# Altium schematic sheet DCSource3V5.SchDoc
size A4; DocumentNumber: 3; SheetNumber: 3; SheetTotal: 5
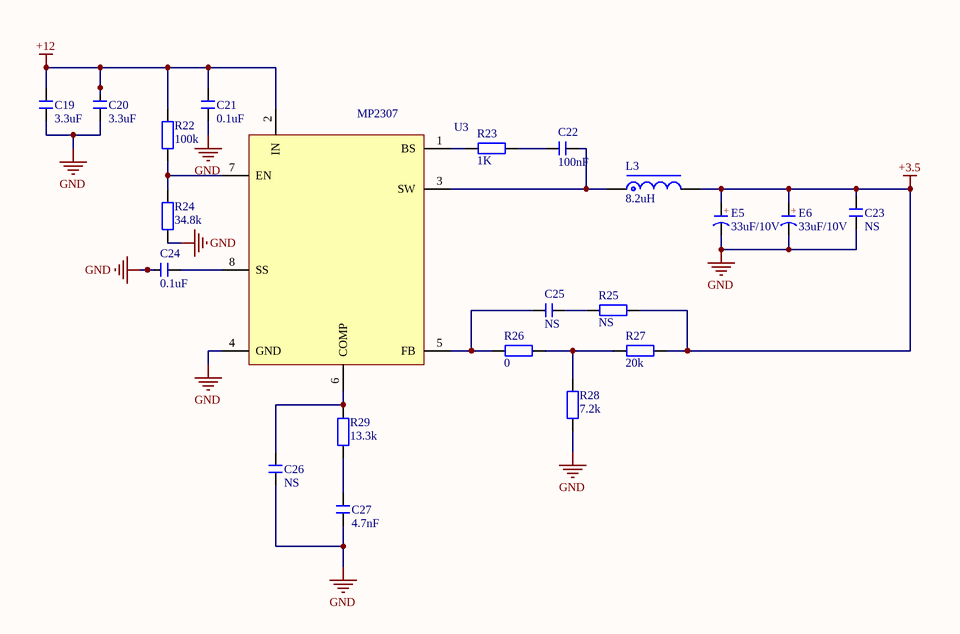
[diagram p0: DCSource3V5.SchDoc]

## Parts
C19  3.3uF  [C 0805_L]
C20  3.3uF  [C 0805_L]
C21  0.1uF  [C 0805_L]
C22  100nF  [C 0805_L]
C23  NS  [C 0805_L]
C24  0.1uF  [C 0805_L]
C25  NS  [C 0805_L]
C26  NS  [C 0805_L]
C27  4.7nF  [C 0805_L]
E5  33uF/10V  [CT 5*6 - C]
E6  33uF/10V  [CT 5*6 - C]
L3  8.2uH  [CD31]
R22  100k  [R 0805_L]
R23  1K  [R 0805_L]
R24  34.8k  [R 0805_L]
R25  NS  [R 0805_L]
R26  0  [R 0805_L]
R27  20k  [R 0805_L]
R28  7.2k  [R 0805_L]
R29  13.3k  [R 0805_L]
U3  MP2307  [SOP8_M]

## Nets
+3.5: C23.2 E5.1(A) E6.1(A) L3.2 R25.1 R27.2
+12: C19.2 C20.2 C21.2 R22.2 U3.2(IN)
GND: C19.1 C20.1 C21.1 C23.1 C24.2 C26.1 C27.1 E5.2(K) E6.2(K) R24.1 R28.1 U3.4(GND)
NetC22_1: C22.1 R23.2
NetC22_2: C22.2 L3.1 U3.3(SW)
NetC24_1: C24.1 U3.8(SS)
NetC25_1: C25.1 R26.1 U3.5(FB)
NetC25_2: C25.2 R25.2
NetC26_2: C26.2 R29.2 U3.6(COMP)
NetC27_2: C27.2 R29.1
NetR22_1: R22.1 R24.2 U3.7(EN)
NetR23_1: R23.1 U3.1(BS)
NetR26_2: R26.2 R27.1 R28.2

## Notes on the sheet
- (in symbol C-CT) +

## Library data of the parts
C19-C27 = C: 无极性贴片电容; 材质: X7R; BOM名称: 无极性贴片电容
E5 E6 = C-CT: 贴片固态电容; BOM名称: 贴片固态电容
L3 = L-CD: 贴片功率电感; BOM名称: 功率电感
R22-R29 = R: 贴片电阻; BOM名称: 贴片电阻
U3 = Component_1